# EAGLE design Pre_schV2.1 (EAGLE 9.6.2)
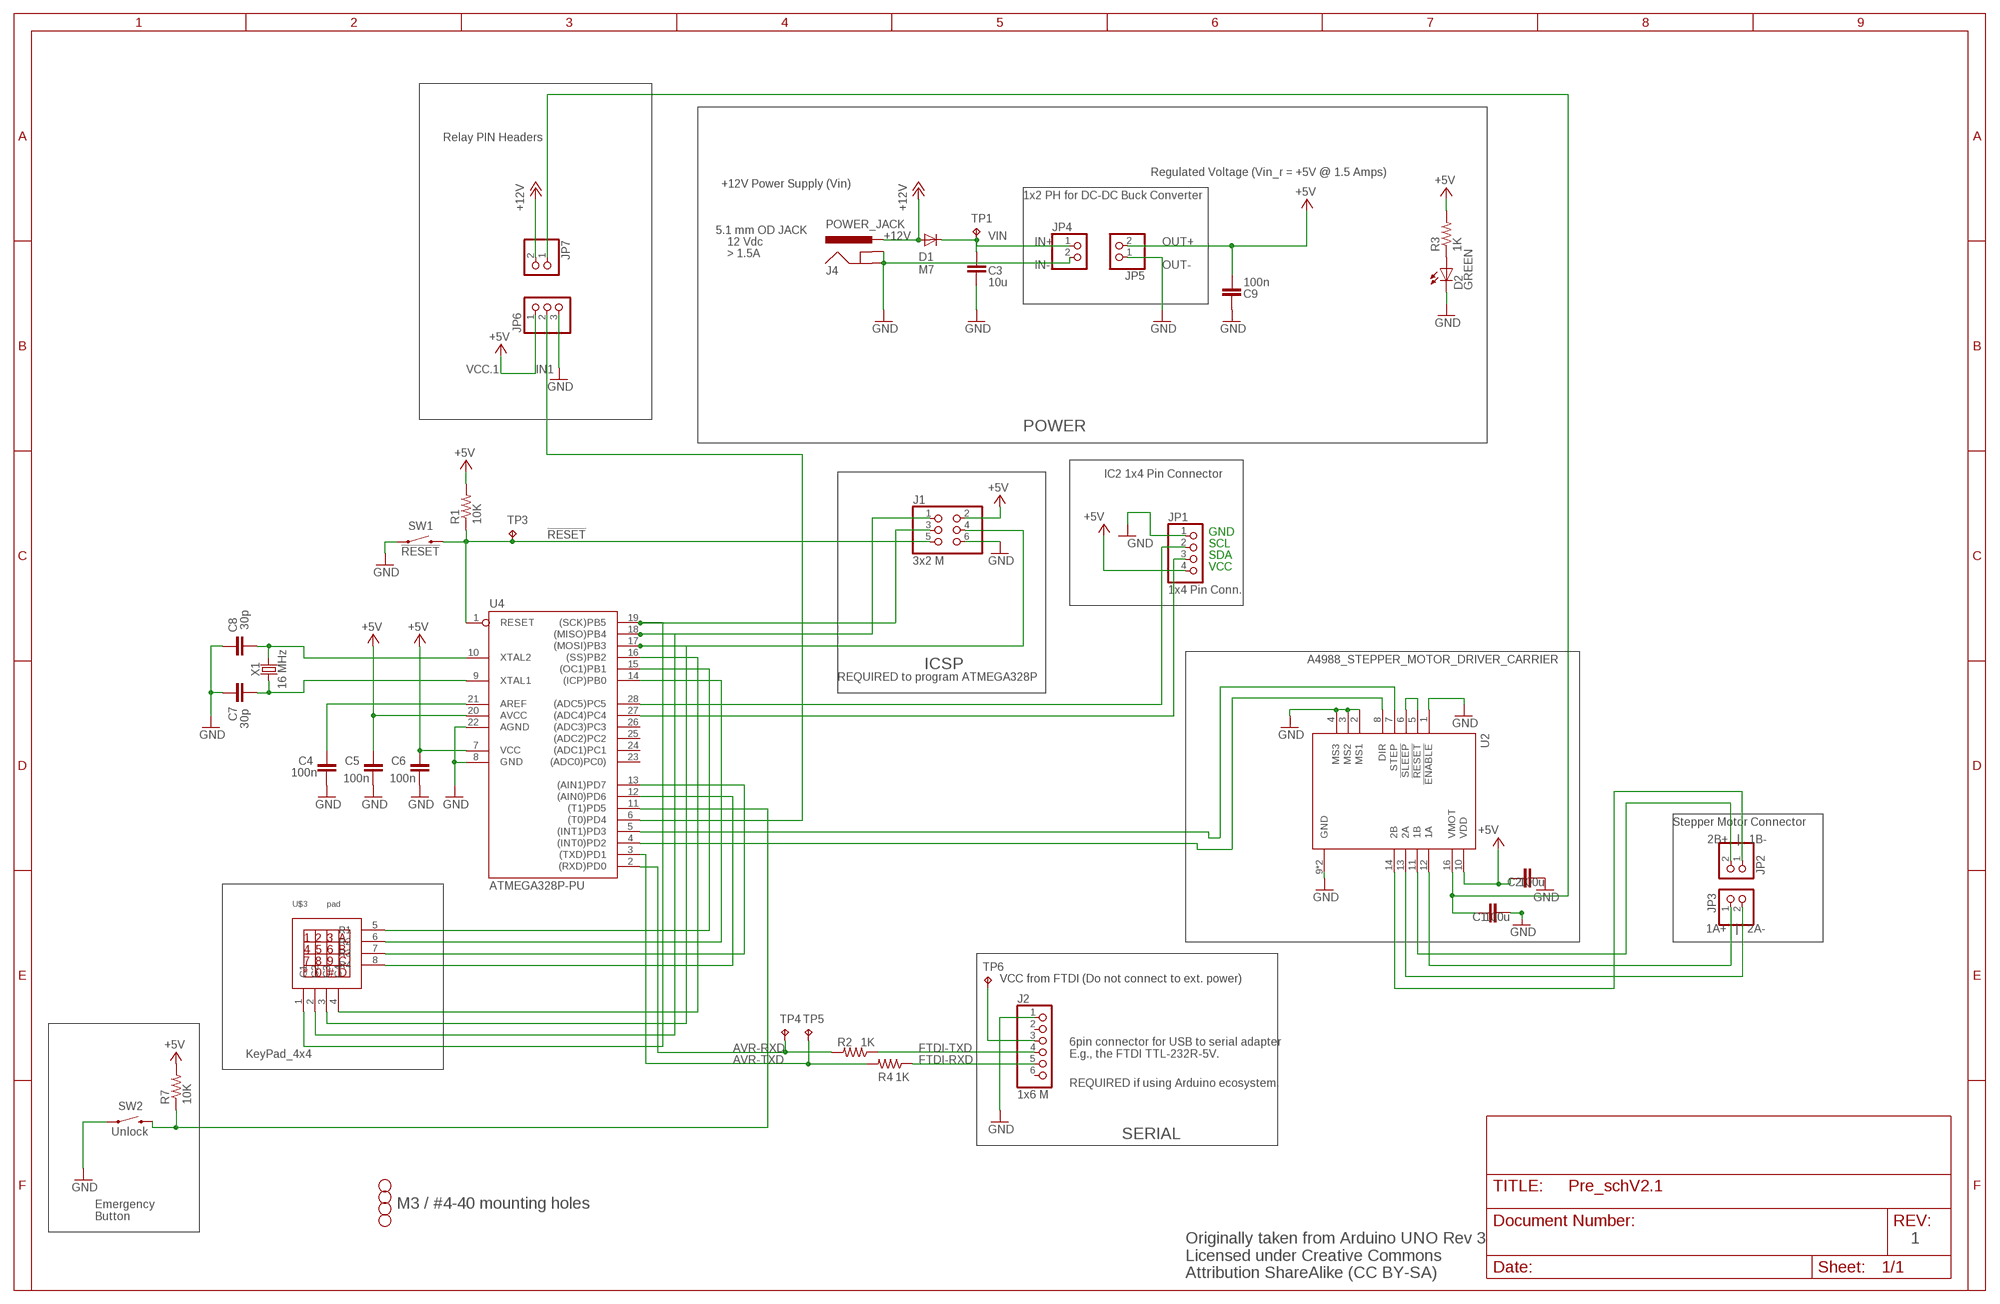
[diagram p0: schematic, sheet 1]

## Parts
C1  100u  C-EUC0805K  [C0805K]
C2  100u  C-EUC0805K  [C0805K]
C3  10u  C-EUC0805K  [C0805K]
C4  100n  C-EUC0805K  [C0805K]
C5  100n  C-EUC0805K  [C0805K]
C6  100n  C-EUC0805K  [C0805K]
C7  30p  C-EUC0805K  [C0805K]
C8  30p  C-EUC0805K  [C0805K]
C9  100n  C-EUC0805K  [C0805K]
D1  M7  DIODE-SMB  [SMB]
D2  GREEN  LEDCHIP-LED0805  [CHIP-LED0805]
H1  STAND-OFF  [STAND-OFF]
H2  STAND-OFF  [STAND-OFF]
H3  STAND-OFF  [STAND-OFF]
H4  STAND-OFF  [STAND-OFF]
J1  3x2 M  PINHD-2X3  [2X03]
J2  1x6 M  PINHD-1X6  [1X06]
J4  POWER_JACK  [POWER_JACK_PTH]
JP1  1x4 Pin Conn.  PINHD-1X4  [1X04]
JP2  2B+ | 1B-  PINHD-1X2  [1X02]
JP3  1A+ | 2A-  PINHD-1X2  [1X02]
JP4  PINHD-1X2  [1X02]
JP5  PINHD-1X2  [1X02]
JP6  PINHD-1X3  [1X03]
JP7  PINHD-1X2  [1X02]
R1  10K  R-US_R0805  [R0805]
R2  1K  R-US_R0805  [R0805]
R3  1K  R-US_R0805  [R0805]
R4  1K  R-US_R0805  [R0805]
R7  10K  R-US_R0805  [R0805]
SW1  !RESET  SWITCH-MOMENTARY-2SMD  [TACTILE_SWITCH_SMD]
SW2  Unlock  SWITCH-MOMENTARY-2SMD  [TACTILE_SWITCH_SMD]
TP1  TPPAD1-13  [P1-13]
TP3  TPPAD1-13  [P1-13]
TP4  TPPAD1-13  [P1-13]
TP5  TPPAD1-13  [P1-13]
TP6  TPPAD1-13  [P1-13]
U2  A4988_STEPPER_MOTOR_DRIVER_CARRIER  [MODULE_A4988_STEPPER_MOTOR_DRIVER_CARRIER]
U4  ATMEGA328P-PU  [DIL28-3]
U$3  pad  KEYPAD4X4  [KEYPAD4X4]
X1  16 MHz  CRYSTALSMD-HC49UP  [HC49UP]

## Nets
!RESET: J1.5 R1.1 SW1.3 TP3.TP U4.1(RESET)
+5V: C2.2 C5.2 C6.2 C9.2 J1.2 JP1.4 JP5.2 JP6.1 R1.2 R3.2 R7.2 U2.10(VDD) U4.7(VCC) U4.20(AVCC)
+12V: D1.A J4.PWR JP7.2
AVR-RXD: R2.2 TP4.TP U4.2((RXD)PD0)
AVR-TXD: R4.2 TP5.TP U4.3((TXD)PD1)
FTDI-RXD: J2.5 R4.1
FTDI-TXD: J2.4 R2.1
GND: C1.1 C2.1 C3.2 C4.1 C5.1 C6.1 C7.2 C8.2 C9.1 D2.C J1.6 J2.1 J4.GND J4.GNDBREAK JP1.1 JP4.2 JP5.1 JP6.3 SW1.1 SW2.1 U2.1(!ENABLE) U2.2(MS1) U2.3(MS2) U2.4(MS3) U2.9(GND) U2.15(GND) U4.8(GND) U4.22(AGND)
MISO: J1.1 U4.18((MISO)PB4) U$3.2(C2)
MOSI: J1.4 U4.17((MOSI)PB3) U$3.3(C3)
N$1: C4.2 U4.21(AREF)
N$2: U2.8(DIR) U4.4((INT0)PD2)
N$3: D2.A R3.1
N$4: U2.7(STEP) U4.5((INT1)PD3)
N$5: J2.3 TP6.TP
N$6: JP1.3 U4.27((ADC4)PC4)
N$8: JP2.2 U2.11(1B)
N$9: JP3.1 U2.12(1A)
N$10: JP3.2 U2.13(2A)
N$11: JP2.1 U2.14(2B)
N$12: JP1.2 U4.28((ADC5)PC5)
N$14: U4.12((AIN0)PD6) U$3.8(R4)
N$15: U4.13((AIN1)PD7) U$3.7(R3)
N$16: U4.14((ICP)PB0) U$3.6(R2)
N$17: U4.15((OC1)PB1) U$3.5(R1)
N$18: U4.16((SS)PB2) U$3.4(C4)
N$20: JP6.2 U4.6((T0)PD4)
N$21: R7.1 SW2.3 U4.11((T1)PD5)
N$22: U2.5(!RESET) U2.6(!SLEEP)
N$23: C1.2 JP7.1 U2.16(VMOT)
SCK: J1.3 U4.19((SCK)PB5) U$3.1(C1)
VIN: C3.1 D1.C JP4.1 TP1.TP
XTAL1: C7.1 U4.9(XTAL1) X1.1
XTAL2: C8.1 U4.10(XTAL2) X1.2
Unconnected: J2.2 J2.6 U4.23((ADC0)PC0)) U4.24((ADC1)PC1) U4.25((ADC2)PC2) U4.26((ADC3)PC3)

## Notes on the sheet
- Relay PIN Headers
- Regulated Voltage (Vin_r = +5V @ 1.5 Amps)
- +12V Power Supply (Vin)
- 1x2 PH for DC-DC Buck Converter
- 5.1 mm OD JACK
- 12 Vdc | IN+ | OUT+
- > 1.5A
- IN- | OUT-
- VCC.1 | IN1
- POWER
- IC2 1x4 Pin Connector
- GND
- SCL
- SDA
- VCC
- ICSP
- REQUIRED to program ATMEGA328P
- Stepper Motor Connector
- VCC from FTDI (Do not connect to ext. power)
- KeyPad_4x4
- 6pin connector for USB to serial adapter
  E.g., the FTDI TTL-232R-5V.
- REQUIRED if using Arduino ecosystem.
- SERIAL
- M3 / #4-40 mounting holes
- Emergency
  Button
- 1
- Originally taken from Arduino UNO Rev 3
  Licensed under Creative Commons 
  Attribution ShareAlike (CC BY-SA)

## Library data of the parts
C1 C2 C4-C6 C9 = rcl:C-EU: CAPACITOR, European symbol; MFR: Samsung; MPN: CL21B104KBCNNNC; SPICEPREFIX: C
C3 = rcl:C-EU: CAPACITOR, European symbol; MFR: Samsung; MPN: CL21A106KOQNNNG; SPICEPREFIX: C
C7 = rcl:C-EU: CAPACITOR, European symbol; DESC: CAP CER 30PF 50V C0G/NP0 0805; MFR: Samsung; MPN: CL21C180JBANNNC; SPICEPREFIX: C
C8 = rcl:C-EU: CAPACITOR, European symbol; DESC: CAP CER 30PF 50V C0G/NP0 0805; MFR: Samsung; MPN: CL21C300JBANNNC; SPICEPREFIX: C
D1 = diode:DIODE-: DIODE; MFR: SMC Diode; MPN: 10BQ030TR
D2 = led:LED: LED OSRAM: - CHIPLED LG R971, LG N971, LY N971, LG Q971, LY Q971, LO R971, LY R971 LH N974, LH R974 LS Q976, LO Q976, LY Q976 LO Q996 - Hyper CHIPLED LW Q18S LB Q993, LB Q99A, LB R99A - SideLED LS A670, LO A670, LY A670, LG A670, LP A670 LB A673, LV A673, LT A673, LW A673 LH A674 LY A675 LS A676, LA A676, LO A676, LY A676, LW A676 LS A679, LY A679, LG A679 - Hyper Micro SIDELED® LS Y876, LA Y876, LO Y876, LY Y876 LT Y87S - SmartLED LW L88C, LW L88S LB L89C, LB L89S, LG L890 LS L89K, LO L89K, LY L89K LS L896, LA L896, LO L896, LY L896 - TOPLED LS T670, LO T670, LY T670, LG T670, LP T670 LSG T670, LSP T670, LSY T670, LOP T670, LYG T670 LG T671, LOG T671, LSG T671 LB T673, LV T673, LT T673, LW T673 LH T674 LS T676, LA T676, LO T676, LY T676, LB T676, LH T676, LSB T676, LW T676 LB T67C, LV T67C, LT T67C, LS T67K, LO T67K, LY T67K, LW E67C LS E67B, LA E67B, LO E67B, LY E67B, LB E67C, LV E67C, LT E67C LW T67C LS T679, LY T679, LG T679 LS T770, LO T770, LY T770, LG T770, LP T770 LB T773, LV T773, LT T773, LW T773 LH T774 LS E675, LA E675, LY E675, LS T675 LS T776, LA T776, LO T776, LY T776, LB T776 LHGB T686 LT T68C, LB T68C - Hyper Mini TOPLED® LB M676 - Mini TOPLED Santana® LG M470 LS M47K, LO M47K, LY M47K Source: http://www.osram.convergy.de LUXEON: - LUMILED® LXK2-PW12-R00, LXK2-PW12-S00, LXK2-PW14-U00, LXK2-PW14-V00 LXK2-PM12-R00, LXK2-PM12-S00, LXK2-PM14-U00 LXK2-PE12-Q00, LXK2-PE12-R00, LXK2-PE12-S00, LXK2-PE14-T00, LXK2-PE14-U00 LXK2-PB12-K00, LXK2-PB12-L00, LXK2-PB12-M00, LXK2-PB14-N00, LXK2-PB14-P00, LXK2-PB14-Q00 LXK2-PR12-L00, LXK2-PR12-M00, LXK2-PR14-Q00, LXK2-PR14-R00 LXK2-PD12-Q00, LXK2-PD12-R00, LXK2-PD12-S00 LXK2-PH12-R00, LXK2-PH12-S00 LXK2-PL12-P00, LXK2-PL12-Q00, LXK2-PL12-R00 Source: www.luxeon.com KINGBRIGHT: KA-3528ASYC Source: www.kingbright.com; MFR: Würth Elektronik; MPN: 150080GS75000
H1-H4 = SparkFun-Hardware:STAND-OFF: Stand Off Drill holes for mechanically mounting via screws, standoffs, etc. Note: Use the keepout ring to avoid running the screw head into surrounding components. Variant Overviews STAND-OFF - Mechanical footprint for a #4 phillips button head screw. STAND-OFF-TIGHT - Mechanical footprint for a #4 phillips button head screw, Example SparkFun Products Screw - Phillips Head (1/4", 4-40, 10 pack) <https://www.sparkfun.com/products/10453> (PRT-10453) Screw - Phillips Head (1/2", 4-40, 10 pack) <https://www.sparkfun.com/products/10452> (PRT-10452) Screw - Phillips Head (3/4", 4-40, 10 pack) <https://www.sparkfun.com/products/10451> (PRT-10451) Screw - Phillips Head (1", 4-40, 10 pack) <https://www.sparkfun.com/products/10450> (PRT-10450)
J1 = SmartPrj:PINHD-2X3: PIN HEADER; MFR: Harwin; MPN: M20-9980345
J2 = pinhead:PINHD-1X6: PIN HEADER; MFR: Sullins; MPN: PRPC006SAAN-RC
J4 = SparkFun-Connectors:POWER_JACK: Power Jack Connector This is the standard 5.5mm barrel jack for power. The PTH is the most common, proven, reliable, footprint. The Slot footprint only works if the mill layer is transmitted to the PCB fab house so be warned. Here are the connectors we sell at SparkFun: DC Barrel Power Jack/Connector <https://www.sparkfun.com/products/119> (PRT-00119) DC Barrel Power Jack/Connector (SMD) <https://www.sparkfun.com/products/12748> (PRT-12748) DC Barrel Jack Adapter - Breadboard Compatible <https://www.sparkfun.com/products/10811> (PRT-10811) It is used on this SparkFun product (and many, many others): SparkFun RedBoard - Programmed with Arduino <https://www.sparkfun.com/products/12757> (DEV-12757) Also, if you need a mating power supply or connector, please check these out: Wall Adapter Power Supply - 9VDC 650mA <https://www.sparkfun.com/products/298> (TOL-00298) DC Barrel Jack Adapter - Male <https://www.sparkfun.com/products/10287> (PRT-10287); MFR: CUI; MPN: PJ-202A; PROD_ID: CONN-08197
JP1 = pinhead:PINHD-1X4: PIN HEADER
JP2-JP5 JP7 = pinhead:PINHD-1X2: PIN HEADER
JP6 = pinhead:PINHD-1X3: PIN HEADER
R1 R7 = rcl:R-US_: RESISTOR, American symbol; MFR: Yageo; MPN: RC0805FR-0710KL; SPICEPREFIX: R
R2-R4 = rcl:R-US_: RESISTOR, American symbol; MFR: Yageo; MPN: RC0805FR-071KL; SPICEPREFIX: R
SW1 SW2 = SparkFun-Electromechanical:SWITCH-MOMENTARY-2: Various NO switches- pushbuttons, reed, etc; DESC: SWITCH TACTILE SPST-NO 0.05A 12V; MFR: C&K; MPN: RS-187R05A2-DS MT RT
TP1 TP3-TP6 = testpad:TP: Test pad
U2 = A4988_STEPPER_MOTOR_DRIVER_CARRIER:A4988_STEPPER_MOTOR_DRIVER_CARRIER: Stepper motor controler; IC: A4988; 1A; Uin mot: 8÷35V; AVAILABILITY: Unavailable; DESCRIPTION: Stepper Motor Driver; MF: Pololu; MP: A4988 STEPPER MOTOR DRIVER CARRIER; PACKAGE: None; PRICE: None
U4 = SmartPrj:ATMEGA328P-: MICROCONTROLLER 4 Kbytes FLASH 128 bytes SRAM 256 bytes EEPROM UART 6-channel 10 bit ADC; MFR: Microchip; MPN: ATMEGA328P-PU
U$3 = keypad_4x4_raw:KEYPAD4X4
X1 = SparkFun-Clocks:CRYSTAL: Crystals (Generic) These are passive quartz crystals, which can be used as a clock source for a microcontroller. Crystal's are two-terminal devices. They require external "load" capacitors to generate an oscillating signal.; DESC: CRYSTAL 16.000 MHZ 18PF SMD; MFR: ECS; MPN: ECS-160-18-5PX-TR

## Net classes
0 default: width 0.254 mm, clearance 0.254 mm

## Board
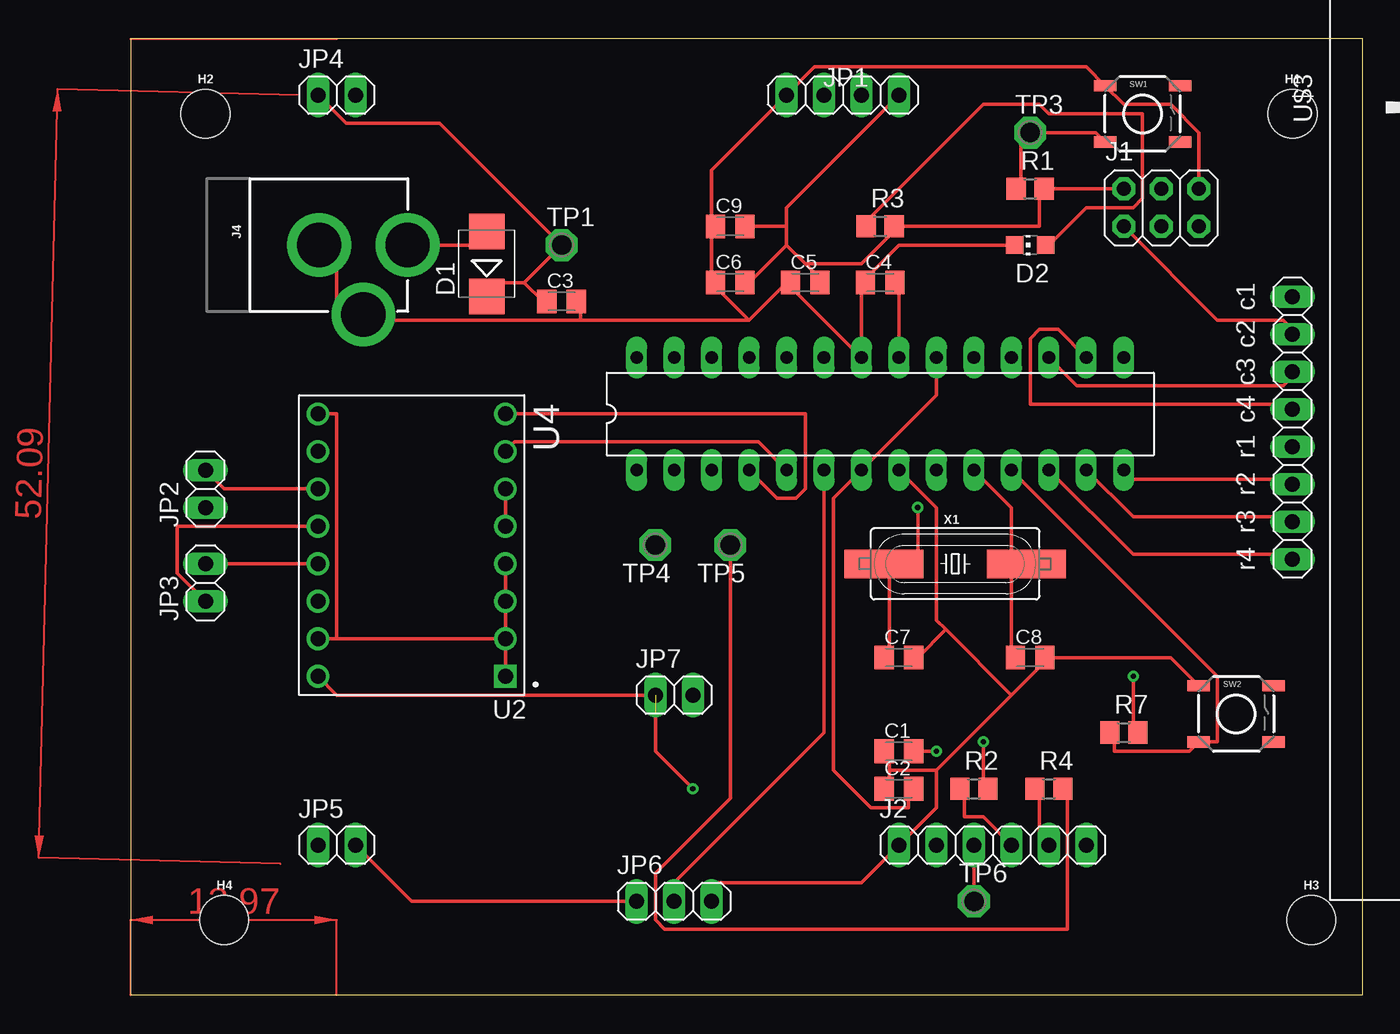
[diagram p1: board, top side]
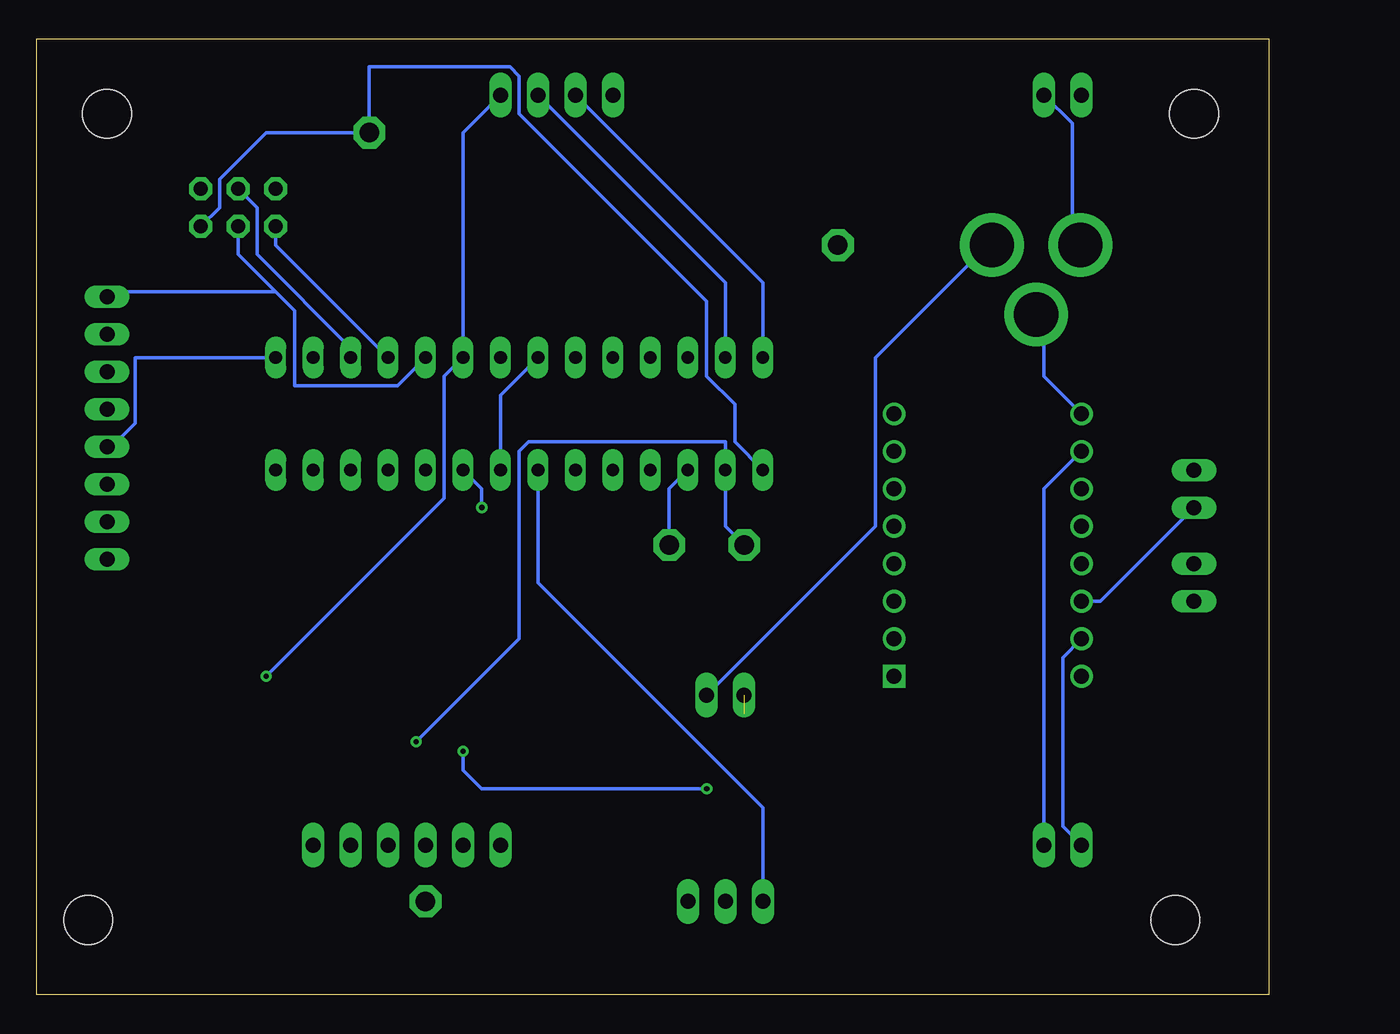
[diagram p2: board, bottom side, seen from below]

Size 83.49 x 64.76 mm. Coordinates in mm from the lower left corner, seen from the top.
Outline: 0,0 83.49,0 83.49,64.76 0,64.76 0,0
Copper layers (1*16): Top 0.035mm / dielectric 1.5mm / Bottom 0.035mm
Design rules "default": minimum track width 6mil, minimum drill 0.35mm, track to track 6mil, track to pad 6mil, pad to pad 6mil, via to via 6mil, smd to smd 6mil, copper to edge 40mil, drill to drill 6mil, minimum pad ring 10mil, minimum via ring 8mil, stop-mask expansion 4mil, vias tented up to drill 0mil, thermal gap 10mil

### Footprints (pad centres in the part's own frame; a part is rotated, then mirrored left to right if it is on the bottom)
C0805K = smd 1.3 x 1.6: 1 -1,0; 2 1,0
SMB = smd 2.4 x 2.4: A 2.2,0; C -2.2,0
CHIP-LED0805 = smd 1.2 x 1.2: A 0,-1.05; C 0,1.05
STAND-OFF = hole 3.302: 0,0
2X03 = drill 0.95 pad 1.55 octagon: 1 -2.54,-1.27; 2 -2.54,1.27; 3 0,-1.27; 4 0,1.27; 5 2.54,-1.27; 6 2.54,1.27
1X06 = drill 1.016 long: 1 -6.35,0; 2 -3.81,0; 3 -1.27,0; 4 1.27,0; 5 3.81,0; 6 6.35,0
POWER_JACK_PTH = drill 2.997 pad 4.318: GND 0,7.7; GNDBREAK 4.7,10.7; PWR 0,13.7
1X04 = drill 1.016 long: 1 -3.81,0; 2 -1.27,0; 3 1.27,0; 4 3.81,0
1X02 = drill 1.016 long: 1 -1.27,0; 2 1.27,0
1X03 = drill 1.016 long: 1 -2.54,0; 2 0,0; 3 2.54,0
R0805 = smd 1.3 x 1.5: 1 -0.95,0; 2 0.95,0
TACTILE_SWITCH_SMD = smd 1.524 x 0.762: 1 -2.54,1.905; 2 2.54,1.905; 3 -2.54,-1.905; 4 2.54,-1.905
P1-13 = drill 1.321 pad 2.159 octagon: TP 0,0
MODULE_A4988_STEPPER_MOTOR_DRIVER_CARRIER = drill 1.02 square: 1 -6.35,8.89 | drill 1.02: 2 -6.35,6.35; 3 -6.35,3.81; 4 -6.35,1.27; 5 -6.35,-1.27; 6 -6.35,-3.81; 7 -6.35,-6.35; 8 -6.35,-8.89; 9 6.35,-8.89; 10 6.35,-6.35; 11 6.35,-3.81; 12 6.35,-1.27; 13 6.35,1.27; 14 6.35,3.81; 15 6.35,6.35; 16 6.35,8.89
DIL28-3 = drill 0.85 pad 1.422 long: 1 -16.51,-3.81; 2 -13.97,-3.81; 3 -11.43,-3.81; 4 -8.89,-3.81; 5 -6.35,-3.81; 6 -3.81,-3.81; 7 -1.27,-3.81; 8 1.27,-3.81; 9 3.81,-3.81; 10 6.35,-3.81; 11 8.89,-3.81; 12 11.43,-3.81; 13 13.97,-3.81; 14 16.51,-3.81; 15 16.51,3.81; 16 13.97,3.81; 17 11.43,3.81; 18 8.89,3.81; 19 6.35,3.81; 20 3.81,3.81; 21 1.27,3.81; 22 -1.27,3.81; 23 -3.81,3.81; 24 -6.35,3.81; 25 -8.89,3.81; 26 -11.43,3.81; 27 -13.97,3.81; 28 -16.51,3.81
KEYPAD4X4 = drill 1.016 long: 1 23.81,-2.54; 2 26.35,-2.54; 3 28.89,-2.54; 4 31.43,-2.54; 5 33.97,-2.54; 6 36.51,-2.54; 7 39.05,-2.54; 8 41.59,-2.54
HC49UP = smd 5.334 x 1.93: 1 -4.826,0; 2 4.826,0

### Placement (x,y rotation side)
C1  52.07,16.51 0 top
C2  52.07,13.97 0 top
C3  29.21,46.99 0 top
C4  50.8,48.26 0 top
C5  45.72,48.26 0 top
C6  40.64,48.26 0 top
C7  52.07,22.86 0 top
C8  60.96,22.86 0 top
C9  40.64,52.07 0 top
D1  24.13,49.53 90 top
D2  60.96,50.8 90 top
H1  78.74,59.69 0 top
H2  5.08,59.69 0 top
H3  80.01,5.08 0 top
H4  6.35,5.08 0 top
J1  69.85,53.34 0 top
J2  58.42,10.16 0 top
J4  5.08,50.8 270 top
JP1  48.26,60.96 0 top
JP2  5.08,34.29 90 top
JP3  5.08,27.94 90 top
JP4  13.97,60.96 0 top
JP5  13.97,10.16 0 top
JP6  36.83,6.35 0 top
JP7  36.83,20.32 0 top
R1  60.96,54.61 0 top
R2  57.15,13.97 0 top
R3  50.8,52.07 0 top
R4  62.23,13.97 0 top
R7  67.31,17.78 0 top
SW1  68.58,59.69 0 top
SW2  74.93,19.05 0 top
TP1  29.21,50.8 0 top
TP3  60.96,58.42 0 top
TP4  35.56,30.48 180 top
TP5  40.64,30.48 180 top
TP6  57.15,6.35 0 top
U2  19.05,30.48 180 top
U4  50.8,39.37 0 top
U$3  81.28,71.12 270 top
X1  55.88,29.21 0 top

### Tracks (layer width: path | path; a pad name or v marks a point on that pad's centre or on a via)
!RESET
  Top 0.254: R1.1 60.32,54.61 60.32,58.42 TP3.TP 65.41,58.42 SW1.3
  Bottom 0.254: U4.1 36.19,37.47 36.19,40.01 38.1,41.91 38.1,46.99 50.8,59.69 50.8,62.23 51.43,62.87 60.96,62.87 TP3.TP 67.94,58.42 71.12,55.24 71.12,53.34 J1.5
+5V  (via drill 0.35)
  Top 0.254: U4.20 54.61,40.64 U4.7 47.62,33.66 47.62,15.24 50.16,12.7 52.7,12.7 52.7,13.97 C2.2 | 44.45,50.8 41.91,48.26 C6.2 | 45.72,49.53 46.99,48.26 C5.2 | 45.72,49.53 44.45,50.8 | JP1.4 44.45,53.34 44.45,52.07 | 44.45,50.8 44.45,52.07 | J1.2 R1.2 61.59,54.61 61.59,52.07 R3.2 51.43,52.07 51.43,51.44 49.53,49.53 45.72,49.53 | v67.94,21.59 67.94,17.78 R7.2 | 44.45,52.07 C9.2 | JP5.2 19.05,6.35 JP6.1
  Bottom 0.254: JP1.4 54.61,58.42 U4.20 55.88,41.91 55.88,33.66 v67.94,21.59 | JP6.1 34.29,12.7 49.53,27.94 U4.7 | U2.10 15.24,34.29 JP5.2
+12V
  Top 0.254: J4.PWR 24.13,50.8 D1.A
  Bottom 0.254: JP7.2 26.67,31.75 26.67,43.18 19.05,50.8 J4.PWR
AVR-RXD  (via drill 0.35)
  Top 0.254: v57.78,17.14 57.78,13.97 R2.2
  Bottom 0.254: v57.78,17.14 50.8,24.13 50.8,36.83 50.16,37.47 36.83,37.47 U4.2 36.83,31.75 TP4.TP
AVR-TXD
  Top 0.254: TP5.TP 40.64,13.34 35.56,8.25 35.56,5.08 36.19,4.45 63.5,4.45 63.5,13.97 R4.2
  Bottom 0.254: U4.3 40.64,34.29 TP5.TP
FTDI-RXD
  Top 0.254: J2.5 61.59,10.16 61.59,13.97 R4.1
FTDI-TXD
  Top 0.254: J2.4 57.78,12.07 56.52,12.07 56.52,13.97 R2.1
GND
  Top 0.254: J4.GND 13.97,50.8 13.97,45.72 J4.GNDBREAK 16.51,45.72 30.48,45.72 | 54.61,15.24 59.69,20.32 | 59.69,20.32 62.23,22.86 | 54.61,15.24 54.61,12.7 J2.1 49.53,7.62 39.37,7.62 JP6.3 | 41.91,45.72 39.37,48.26 | 44.45,48.26 41.91,45.72 | 39.37,48.26 39.37,52.07 | 39.37,52.07 39.37,55.88 JP1.1 46.36,62.87 64.77,62.87 SW1.1 67.31,60.33 70.48,60.33 72.39,58.42 J1.6 | 39.37,48.26 C6.1 | D2.C 52.07,50.8 49.53,48.26 | 49.53,48.26 U4.22 44.45,48.26 | 49.53,48.26 C4.1 | 44.45,48.26 C5.1 | 55.24,24.77 54.61,25.4 54.61,33.02 U4.8 | 55.24,24.77 59.69,20.32 | 41.91,45.72 30.48,45.72 | U2.2 U2.1 | U2.4 U2.3 U2.2 | U2.15 13.97,24.13 | 13.97,24.13 U2.2 | 51.43,15.24 51.43,16.51 C1.1 | 51.43,15.24 51.43,13.97 C2.1 | SW2.1 70.48,22.86 62.23,22.86 | 62.23,22.86 C8.2 | 30.48,45.72 30.48,46.99 C3.2 | 55.24,24.77 53.34,22.86 C7.2 | 39.37,52.07 C9.1 | 54.61,15.24 51.43,15.24 | 13.97,24.13 13.97,39.37 U2.9
  Bottom 0.254: U4.8 52.07,40.64 U4.22 | JP5.1 13.97,11.43 13.97,22.86 U2.15 | JP4.2 13.33,59.05 13.33,50.8 J4.GND | U2.9 15.24,41.91 15.24,45.72 J4.GNDBREAK
MISO
  Top 0.254: J1.1 73.66,45.72 78.1,45.72 78.74,45.09 U$3.2
  Bottom 0.254: U4.18 67.31,50.8 J1.1
MOSI
  Top 0.254: U4.17 64.13,41.27 78.1,41.27 78.74,41.91 U$3.3
  Bottom 0.254: J1.4 68.58,53.34 68.58,50.16 62.23,43.81 U4.17
N$1
  Top 0.254: U4.21 52.07,48.26 C4.2
N$2
  Top 0.254: U4.4 43.81,33.66 45.08,33.66 45.72,34.29 45.72,39.37 U2.8
N$3
  Top 0.254: D2.A 62.23,50.8 64.77,53.34 67.94,53.34 68.58,53.98 68.58,59.69 62.23,59.69 61.59,60.33 57.78,60.33 49.53,52.07 R3.1
N$4
  Top 0.254: U4.5 42.55,37.47 26.04,37.47 U2.7
N$5
  Top 0.254: TP6.TP J2.3
N$6
  Bottom 0.254: U4.27 36.83,48.26 JP1.3
N$8
  Top 0.254: JP2.2 6.35,34.29 U2.11
N$9
  Top 0.254: JP3.1 3.17,28.57 3.17,31.75 U2.12
N$10
  Top 0.254: U2.13 JP3.2
N$11
  Bottom 0.254: JP2.1 11.43,26.67 U2.14
N$12
  Bottom 0.254: U4.28 34.29,48.26 JP1.2
N$14
  Top 0.254: U4.12 67.94,29.84 78.74,29.84 U$3.8
N$15
  Top 0.254: U4.13 67.94,32.38 78.74,32.38 U$3.7
N$16
  Top 0.254: U4.14 67.94,34.93 78.74,34.93 U$3.6
N$17
  Bottom 0.254: U4.15 76.83,43.18 76.83,38.73 78.74,36.83 U$3.5
N$18
  Top 0.254: U4.16 62.86,45.09 61.59,45.09 60.96,44.45 60.96,40.01 78.74,40.01 U$3.4
N$20
  Top 0.254: U4.6 46.99,17.78 36.83,7.62 JP6.2
N$21
  Top 0.254: R7.1 66.67,17.78 66.67,16.51 71.75,16.51 SW2.3 73.66,17.14 73.66,21.59 U4.11
N$22
  Top 0.254: U2.6 U2.5
N$23  (via drill 0.35)  (1 unrouted)
  Top 0.254: v54.61,16.51 C1.2 | U2.16 13.97,20.32 JP7.1 | v38.1,13.97 35.56,16.51 35.56,19.05
  Bottom 0.254: v54.61,16.51 54.61,15.24 53.34,13.97 v38.1,13.97
SCK
  Bottom 0.254: U4.19 59.05,41.27 66.04,41.27 66.04,46.36 67.31,47.62 | 67.31,47.62 69.85,50.16 J1.3 | 67.31,47.62 78.74,47.62 U$3.1
VIN
  Top 0.254: 26.67,48.26 24.13,48.26 D1.C | 26.67,48.26 TP1.TP 20.96,59.05 14.6,59.05 JP4.1 | 26.67,48.26 27.94,46.99 C3.1
XTAL1  (via drill 0.35)
  Top 0.254: 51.43,29.21 51.43,22.86 C7.1 | v53.34,33.02 53.34,29.21 51.43,29.21 | 51.43,29.21 X1.1
  Bottom 0.254: U4.9 53.34,34.29 v53.34,33.02
XTAL2
  Top 0.254: 59.69,29.21 59.69,33.02 U4.10 | 59.69,29.21 59.69,22.86 C8.1 | 59.69,29.21 X1.2
(copper drawn outside any net)
  shapes: Top area x3